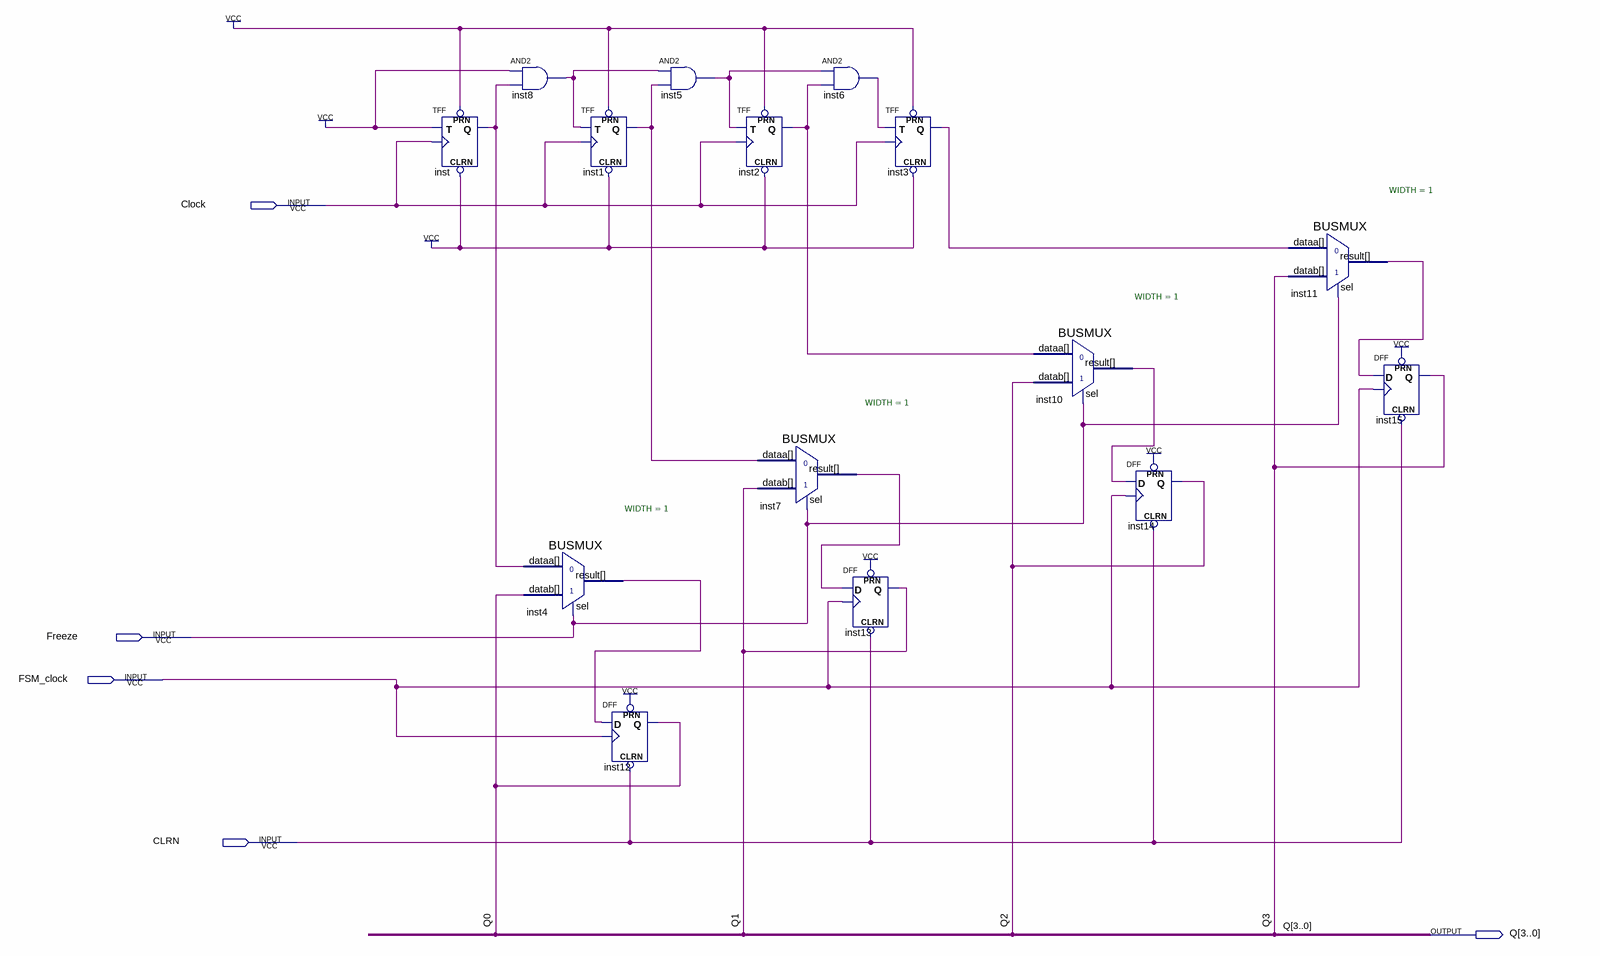
[diagram p0: schematic sheet]
// Quartus schematic freezeCounter.bdf as structural Verilog: 15 symbols, 5 pins
module freezeCounter (
  input  Clock,
  input  Freeze,
  input  FSM_clock,
  input  CLRN,
  output [3:0] Q
);

  wire inst1_q, inst2_q, inst3_q, inst4_result, inst5_out, inst6_out, inst7_result, inst8_out, inst10_result,
       inst11_result, inst_q;

  TFF inst (.PRN(1'b1), .CLRN(1'b1), .T(1'b1), .CLK(Clock), .Q(inst_q));
  and inst8 (inst8_out, 1'b1, inst_q);
  BUSMUX #(.WIDTH(1)) inst4 (.datab(Q[0]), .sel(Freeze), .dataa(inst_q), .result(inst4_result));
  TFF inst1 (.PRN(1'b1), .CLRN(1'b1), .T(inst8_out), .CLK(Clock), .Q(inst1_q));
  DFF inst12 (.CLRN(CLRN), .CLK(FSM_clock), .D(inst4_result), .PRN(1'b1), .Q(Q[0]));
  and inst5 (inst5_out, inst8_out, inst1_q);
  TFF inst2 (.PRN(1'b1), .CLRN(1'b1), .T(inst5_out), .CLK(Clock), .Q(inst2_q));
  BUSMUX #(.WIDTH(1)) inst7 (.datab(Q[1]), .sel(Freeze), .dataa(inst1_q), .result(inst7_result));
  and inst6 (inst6_out, inst5_out, inst2_q);
  DFF inst13 (.CLRN(CLRN), .CLK(FSM_clock), .D(inst7_result), .PRN(1'b1), .Q(Q[1]));
  TFF inst3 (.PRN(1'b1), .CLRN(1'b1), .T(inst6_out), .CLK(Clock), .Q(inst3_q));
  BUSMUX #(.WIDTH(1)) inst10 (.datab(Q[2]), .sel(Freeze), .dataa(inst2_q), .result(inst10_result));
  DFF inst14 (.CLRN(CLRN), .CLK(FSM_clock), .D(inst10_result), .PRN(1'b1), .Q(Q[2]));
  BUSMUX #(.WIDTH(1)) inst11 (.datab(Q[3]), .sel(Freeze), .dataa(inst3_q), .result(inst11_result));
  DFF inst15 (.CLRN(CLRN), .CLK(FSM_clock), .D(inst11_result), .PRN(1'b1), .Q(Q[3]));
endmodule
